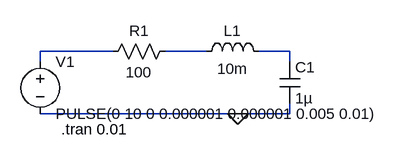
[diagram p0: schematic RLC_Circuit.asc]
RLC_Circuit.asc, the LTspice schematic file:
Version 4.1
SHEET 1 880 680
WIRE 128 80 16 80
WIRE 272 80 208 80
WIRE 400 80 352 80
WIRE 16 96 16 80
WIRE 400 96 400 80
WIRE 320 176 16 176
WIRE 400 176 400 160
WIRE 400 176 320 176
FLAG 320 176 0
SYMBOL voltage 16 80 R0
WINDOW 123 0 0 Left 0
WINDOW 39 0 0 Left 0
SYMATTR InstName V1
SYMATTR Value PULSE(0 10 0 0.000001 0.000001 0.005 0.01)
SYMBOL res 224 64 R90
WINDOW 0 0 56 VBottom 2
WINDOW 3 32 56 VTop 2
SYMATTR InstName R1
SYMATTR Value 100
SYMBOL cap 384 96 R0
SYMATTR InstName C1
SYMATTR Value 1µ
SYMBOL ind 256 96 R270
WINDOW 0 32 56 VTop 2
WINDOW 3 5 56 VBottom 2
SYMATTR InstName L1
SYMATTR Value 10m
TEXT 48 200 Left 2 !.tran 0.01

The netlist it stands for:
* RLC_Circuit.asc
V1 N001 0 PULSE(0 10 0 0.000001 0.000001 0.005 0.01)
R1 N002 N001 100
C1 N003 0 1µ
L1 N002 N003 10m
.tran 0.01
.backanno
.end